# Altium schematic sheet zigo_schem.SchDoc
size A4; SheetNumber: 1; SheetTotal: 1
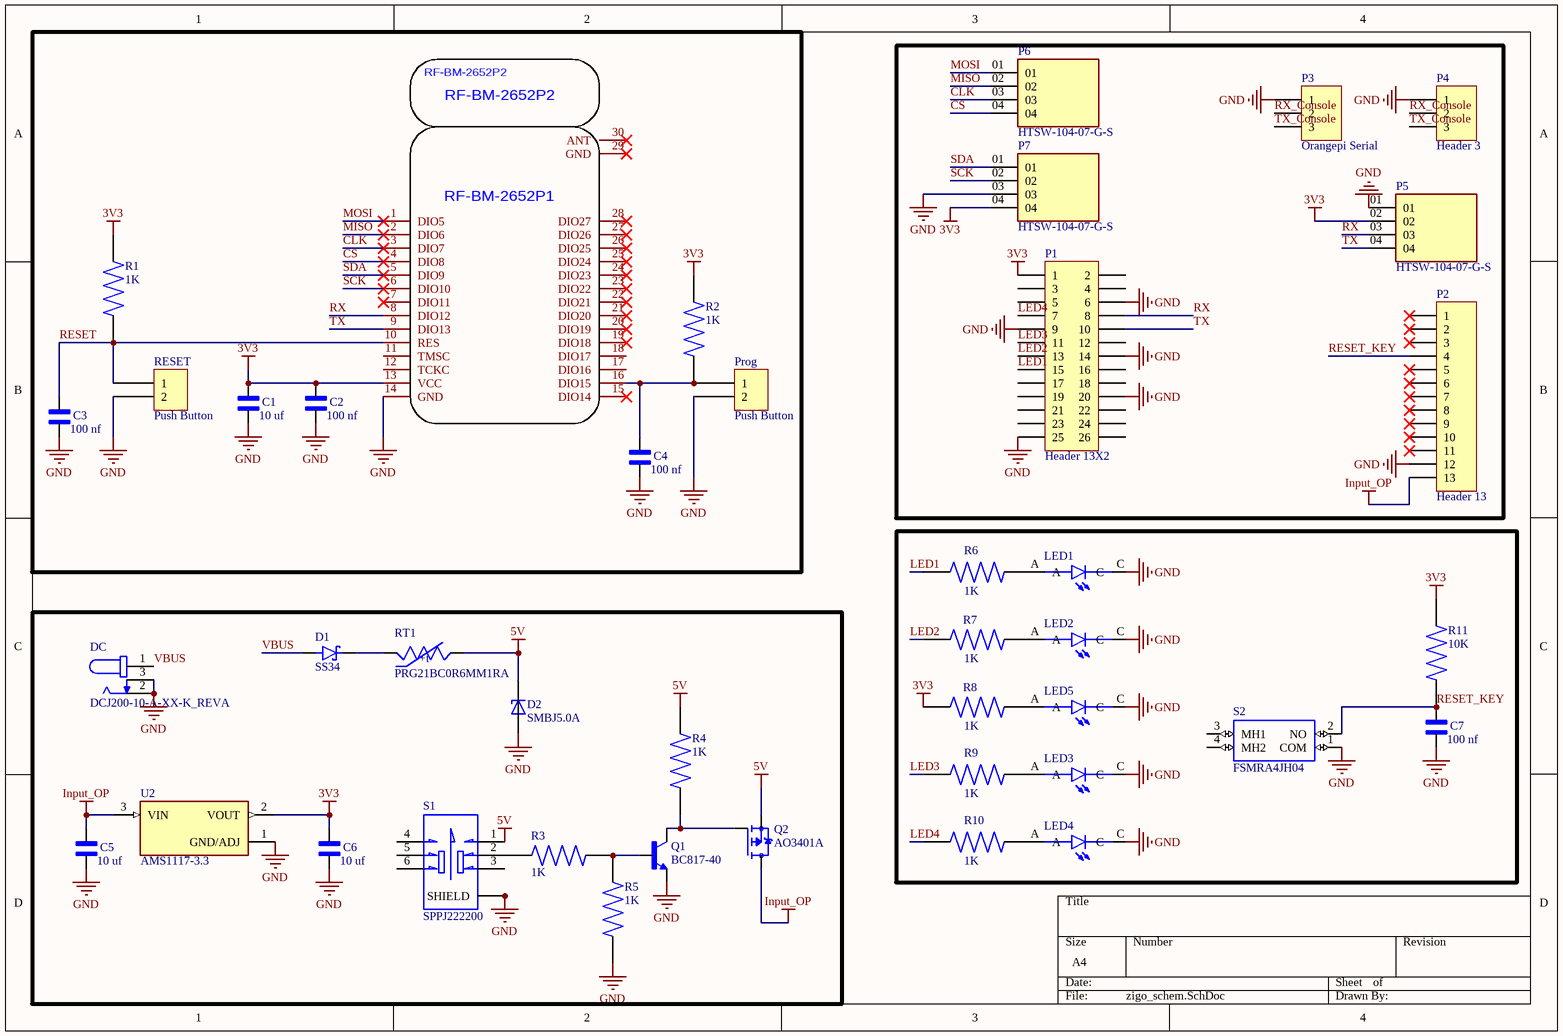
[diagram p0: zigo_schem.SchDoc]

## Parts
C1  10 uf  [CAPC2012X90N]
C2  100 nf  [CAPC2012X90N]
C3  100 nf  [CAPC2012X90N]
C4  100 nf  [CAPC2012X90N]
C5  10 uf  [CAPC2012X90N]
C6  10 uf  [CAPC2012X90N]
C7  100 nf  [CAPC2012X90N]
cc  RF-BM-2652P2  [PCBComponent_1 - duplicate]
D1  SS34  [DIOM7959X265N]
D2  SMBJ5.0A  [DIOM4336X265N]
DC  DCJ200-10-A-XX-K_REVA  [GCT_DCJ200-10-A-XX-K_REVA]
LED1  597-3305-607F  [LEDC2012X70N]  (value not drawn)
LED2  597-3305-607F  [LEDC2012X70N]  (value not drawn)
LED3  597-3305-607F  [LEDC2012X70N]  (value not drawn)
LED4  597-3305-607F  [LEDC2012X70N]  (value not drawn)
LED5  597-3305-607F  [LEDC2012X70N]  (value not drawn)
P1  Header 13X2  [HDR2X13]
P2  Header 13  [HDR1X13]
P3  Orangepi Serial  [HDR1X3]
P4  Header 3  [HDR1X3]
P5  HTSW-104-07-G-S  [SAMTEC_HTSW-104-07-G-S]
P6  HTSW-104-07-G-S  [SAMTEC_HTSW-104-07-G-S]
P7  HTSW-104-07-G-S  [SAMTEC_HTSW-104-07-G-S]
Prog  Push Button  [Push Button]
Q1  BC817-40  [SOT95P240X120-3N]
Q2  AO3401A  [SOT23-3]
R1  1K  [RESC2012X65N]
R2  1K  [RESC2012X65N]
R3  1K  [RESC2012X65N]
R4  1K  [RESC2012X65N]
R5  1K  [RESC2012X65N]
R6  1K  [RESC2012X65N]
R7  1K  [RESC2012X65N]
R8  1K  [RESC2012X65N]
R9  1K  [RESC2012X65N]
R10  1K  [RESC2012X65N]
R11  10K  [RESC2012X65N]
RESET  Push Button  [Push Button]
RT1  PRG21BC0R6MM1RA  [THRMC2012X110N]
S1  SPPJ222200  [SW_SPPJ222200]
S2  FSMRA4JH04  [FSMRA4JH04]
U2  AMS1117-3.3  [SOT229P700X180-4N]

## Nets
3V3: C1.2 C2.2 C6.2 cc.13(VCC) P1.1 P5.02 P7.04 R1.2 R2.2 R8.1 R11.2 U2.2(VOUT)
5V: D2.C Q2.2(S) R4.1 RT1.2 S1.1
GND: C1.1 C2.1 C3.1 C4.1 C5.1 C6.1 C7.1 cc.14(GND) D2.A DC.2 DC.3 LED1.C LED2.C LED3.C LED4.C LED5.C P1.6 P1.9 P1.14 P1.20 P1.25 P2.12 P3.1 P4.1 P5.01 P7.03 Prog.2 Q1.2(E) R5.2 RESET.2 S1.S1(SHIELD) S1.S2(SHIELD) S2.1(COM) U2.1(GND/ADJ)
Input_OP: C5.2 P2.13 Q2.3(D) U2.3(VIN)
CLK: cc.3(DIO7) P6.03
CS: cc.4(DIO8) P6.04
LED1: P1.15 R6.1
LED2: P1.13 R7.1
LED3: P1.11 R9.1
LED4: P1.7 R10.1
MISO: cc.2(DIO6) P6.02
MOSI: cc.1(DIO5) P6.01
RESET: C3.2 cc.10(RES) R1.1 RESET.1
RESET_KEY: C7.2 P2.4 R11.1 S2.2(NO)
RX: cc.8(DIO12) P1.8 P5.03
RX_Console: P3.2 P4.2
SCK: cc.6(DIO10) P7.02
SDA: cc.5(DIO9) P7.01
TX: cc.9(DIO13) P1.10 P5.04
TX_Console: P3.3 P4.3
VBUS: D1.A DC.1
NetC4_2: C4.2 cc.16(DIO15) Prog.1 R2.1
NetD1_C: D1.C(K) RT1.1
NetLED1_A: LED1.A R6.2
NetLED2_A: LED2.A R7.2
NetLED3_A: LED3.A R9.2
NetLED4_A: LED4.A R10.2
NetLED5_A: LED5.A R8.2
NetQ1_1: Q1.1(B) R3.1 R5.1
NetQ1_3: Q1.3(C) Q2.1(G) R4.2
NetR3_2: R3.2 S1.2

Not connected (* = marked no-connect by the designer): cc 7(DIO11)* 11(TMSC) 12(TCKC) 15(DIO14)* 17(DIO16) 18(DIO17) 19(DIO18)* 20(DIO19)* 21(DIO20)* 22(DIO21)* 23(DIO22)* 24(DIO23)* 25(DIO24)* 26(DIO25)* 27(DIO26)* 28(DIO27)* 29(GND)* 30(ANT)*; P1 2 3 4 5 12 16 17 18 19 21 22 23 24 26; P2 1* 2* 3* 5* 6* 7* 8* 9* 10* 11*; S1 3 4 5 6; S2 3(MH1) 4(MH2)

## Notes on the sheet
- (in symbol PRG21BC0R6MM1RA) +t
- (in symbol RF-BM-2652P2) RF-BM-2652P1

## Library data of the parts
C1-C7 = VJ0805Y104KXXCW1BC: Capacitor: ceramic; MLCC; 100nF; 25V; X7R; Â±10%; SMD; 0805; MF: Vishay Vitramon; SnapEDA_Link: https://www.snapeda.com/parts/VJ0805Y104KXXCW1BC/Vishay/view-part/?ref=snap; Package: 0805-2 VISHAY; Value: *; MP: VJ0805Y104KXXCW1BC; Check_prices: https://www.snapeda.com/parts/VJ0805Y104KXXCW1BC/Vishay/view-part/?ref=eda
D1 = SS34: Diode Schottky 40 V 3A Surface Mount SMC (DO-214AB); MF: onsemi; SnapEDA_Link: https://www.snapeda.com/parts/SS34/Onsemi/view-part/?ref=snap; Package: SMC-2 ON Semiconductor; Value: *; MP: SS34; Check_prices: https://www.snapeda.com/parts/SS34/Onsemi/view-part/?ref=eda
D2 = SMBJ5.0A: 600W, 6.7V, 5%, Unidirectional, TVS; MF: Taiwan Semiconductor; SnapEDA_Link: https://www.snapeda.com/parts/SMBJ5.0A/taiwan/view-part/?ref=snap; Package: SMD-2 Taiwan Semiconductor; Value: *; MP: SMBJ5.0A; Check_prices: https://www.snapeda.com/parts/SMBJ5.0A/taiwan/view-part/?ref=eda
DC = DCJ200-10-A-XX-K_REVA: Power Barrel Connector Jack 2.05mm ID (0.081), 5.50mm OD (0.217) Through Hole, Right Angle; MF: Global Connector Technology; MP: DCJ200-10-A-K1-K; SnapEDA_Link: https://www.snapeda.com/parts/DCJ200-10-A-K1-K/Global+Connector+Technology/view-part/?ref=snap; Package: None; Value: *; Check_prices: https://www.snapeda.com/parts/DCJ200-10-A-K1-K/Global+Connector+Technology/view-part/?ref=eda
LED1-LED5 = 597-3305-607F: LED Uni-Color Green 4-Pin Chip 0805 T/R; Availability: Unavailable; Value: *; Price: None; MP: 597-3305-607F; Package: None
P1 = Header 13X2: Header, 13-Pin, Dual row; LatestRevisionDate: 17-Jul-2002; LatestRevisionNote: Re-released for DXP Platform.; Publisher: Altium Limited
P2 = Header 13: Header, 13-Pin; LatestRevisionDate: 17-Jul-2002; LatestRevisionNote: Re-released for DXP Platform.; Publisher: Altium Limited
P3 P4 = Header 3: Header, 3-Pin; LatestRevisionDate: 17-Jul-2002; LatestRevisionNote: Re-released for DXP Platform.; Publisher: Altium Limited
Q1 = BC817-40: BJT, SOT-23, 45V, 800mA, NPN, 0.31W, 150Â°C; MF: Diotec Semiconductor; SnapEDA_Link: https://www.snapeda.com/parts/BC817-40/Diotec/view-part/?ref=snap; Package: SOT-23 Diotec; Value: *; MP: BC817-40; Check_prices: https://www.snapeda.com/parts/BC817-40/Diotec/view-part/?ref=eda
Q2 = AO3401A: P-Channel 30 V 4A (Ta) 1.4W (Ta) Surface Mount SOT-23-3; MF: Alpha & Omega Semiconductor; SnapEDA_Link: https://www.snapeda.com/parts/AO3401A/Alpha/view-part/?ref=snap; Package: SOT-23 Alpha &amp; Omega Semiconductor; Value: *; MP: AO3401A; Check_prices: https://www.snapeda.com/parts/AO3401A/Alpha/view-part/?ref=eda
R1-R11 = RN73C2A5K11BTD: RES SMD 5.11KOHM 0.1% 1/10W 0805; Power_Rating: .1 W; Resistance: 5.11K; MF: TE Connectivity; Tolerance: .1%; SnapEDA_Link: https://www.snapeda.com/parts/RN73C2A5K11BTD/TE+Connectivity+Passive+Product/view-part/?ref=snap; Package: 0805; Value: *; MP: RN73C2A5K11BTD; EU_RoHS_Compliance: Compliant; Check_prices: https://www.snapeda.com/parts/RN73C2A5K11BTD/TE+Connectivity+Passive+Product/view-part/?ref=eda
S1 = SPPJ222200: Switch Push Button N.O./N.C. DPDT Plunger 0.2A 30VDC Latching PC Pins Bracket Mount/Through Hole Bulk; MF: ALPS; SnapEDA_Link: https://www.snapeda.com/parts/SPPJ222200/ALPS/view-part/699467/?ref=snap; Value: *; Availability: Warning; Price: None; Mouser-Purchase-URL: https://snapeda.com/shop?store=Mouser&id=699467; MP: SPPJ222200; Package: None
S2 = FSMRA4JH04: Switch, Pushbutton, Tactile, Single Pole, 50mA, Right Angle; MF: TE Connectivity; MP: FSMRA4JH04; Package: None; Purchase-URL: https://pricing.snapeda.com/search/part/FSMRA4JH04/?ref=eda; Check_prices: https://www.snapeda.com/parts/FSMRA4JH04/TE%20Connectivity/view-part/45679/?ref=eda; Availability: Good; Price: None; SnapEDA_Link: https://www.snapeda.com/parts/FSMRA4JH04/TE%20Connectivity/view-part/45679/?ref=snap; Value: *
U2 = AMS1117-3.3: Sot223/Pkg 1-Amp 3.3-Volt Low Drop Out Voltage Regulatator; MF: Advanced Monolithic Systems; SnapEDA_Link: https://www.snapeda.com/parts/AMS1117-3.3/Advanced+Monolithic+Systems/view-part/?ref=snap; Package: SOT-223 Seeed Technology; Value: *; MP: AMS1117-3.3; Check_prices: https://www.snapeda.com/parts/AMS1117-3.3/Advanced+Monolithic+Systems/view-part/?ref=eda
P5-P7 = HTSW-104-07-G-S: Availability: Unavailable; Price: None; Package: None; Value: *; MP: HTSW-104-07-G-S
RT1 = PRG21BC0R6MM1RA: Package: None; Price: None; Value: *; MP: PRG21BC0R6MM1RA; Availability: Unavailable